# Altium schematic sheet Zero-Cross_Detection.SchDoc
size A4; SheetNumber: 7; SheetTotal: 7
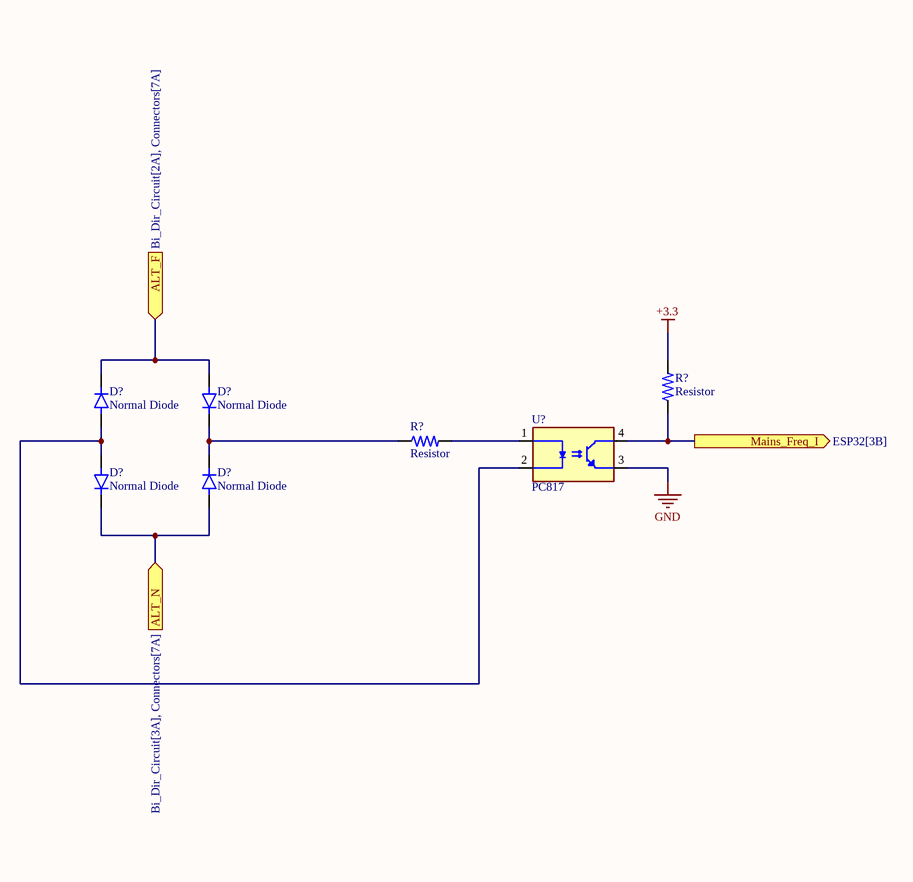
[diagram p0: Zero-Cross_Detection.SchDoc]

## Parts
(Parts that share a designator on the sheet are numbered #1, #2 ... from top to bottom, then left to right.)
D?#1  Normal Diode  [Common Trhough Hole]
D?#2  Normal Diode  [Common Trhough Hole]
D?#3  Normal Diode  [Common Trhough Hole]
D?#4  Normal Diode  [Common Trhough Hole]
R?#1  Resistor  [Resistor_Through Hole]
R?#2  Resistor  [Resistor_Through Hole]
U?  PC817  [PC817]

## Ports
ALT_F (in, see Bi_Dir_Circuit[2A], Connectors[7A]), ALT_N (in, see Bi_Dir_Circuit[3A], Connectors[7A]), Mains_Freq_I (out, see ESP32[3B])

## Nets
+3.3: R?#1.2
GND: U?.3(EMITTER)
ALT_F: D?#1.1(K) D?#2.2(A) ; port ALT_F
ALT_N: D?#3.1(K) D?#4.2(A) ; port ALT_N
Mains_Freq_I: R?#1.1 U?.4(COLLECTOR) ; port Mains_Freq_I
NetD?#1_2: D?#1.2(A) D?#3.2(A) U?.2(CATHODE)
NetD?#2_1: D?#2.1(K) D?#4.1(K) R?#2.1
NetR?#2_2: R?#2.2 U?.1(ANODE)

## Library data of the parts
D?#1-D?#4 = Normal Diode: MF: NTE Electronics, Inc.; MP: 1N4007; Package: DO-41 NTE Electronics; Check_prices: https://www.snapeda.com/parts/1N4007/NTE+Electronics/view-part/?ref=eda; Value: *; Purchase-URL: https://pricing.snapeda.com/search/part/1N4007/?ref=eda; Availability: In Stock; SnapEDA_Link: https://www.snapeda.com/parts/1N4007/NTE+Electronics/view-part/?ref=snap; Price: None
R?#1 R?#2 = Resistor: Power_Rating: .25 W; MP: 2-2176053-0; Tolerance: 1%; Resistance: .33; MF: TE Connectivity; Price: None; Availability: In Stock; EU_RoHS_Compliance: Compliant with Exemptions; Package: 0805; Value: *; SnapEDA_Link: https://www.snapeda.com/parts/2-2176053-0/TE+Connectivity/view-part/?ref=snap; Check_prices: https://www.snapeda.com/parts/2-2176053-0/TE+Connectivity/view-part/?ref=eda
U? = PC817: Optoisolator Transistor Output - 1 Channel 4-DIP; MP: PC817X3NSZ1B; MF: Sharp Microelectronics; SnapEDA_Link: https://www.snapeda.com/parts/PC817X3NSZ1B/Sharp+Microelectronics/view-part/?ref=snap; Price: None; Purchase-URL: https://pricing.snapeda.com/search/part/PC817X3NSZ1B/?ref=eda; Check_prices: https://www.snapeda.com/parts/PC817X3NSZ1B/Sharp+Microelectronics/view-part/?ref=eda; Value: *; Availability: In Stock; Package: DIP-4 Sharp Microelectronics